# EAGLE design AMFS PCB5 (EAGLE 9.6.2)
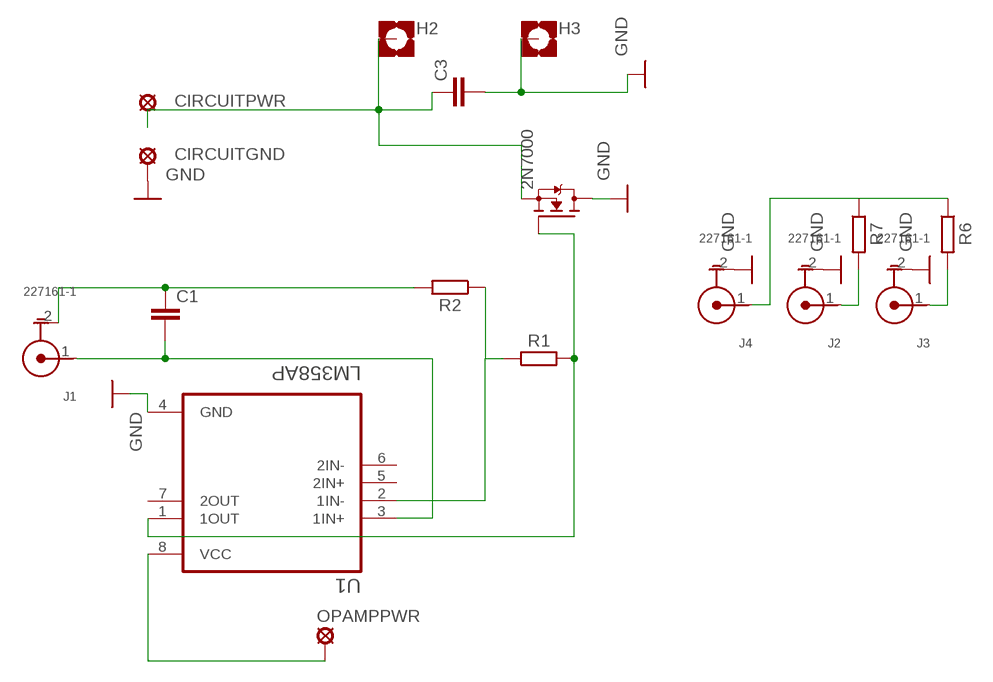
[diagram p0: schematic, sheet 1]

## Parts
C1  C5/3.5  [C5B3.5]
C3  C5/3.5  [C5B3.5]
CIRCUITGND  MCS10B  [MCS10B]
CIRCUITPWR  MCS10B  [MCS10B]
H2  MOUNT-PAD-SQUARE2.8  [2,8-PAD-SQUARE]
H3  MOUNT-PAD-SQUARE2.8  [2,8-PAD-SQUARE]
J1  227161-1  [TE_227161-1]
J2  227161-1  [TE_227161-1]
J3  227161-1  [TE_227161-1]
J4  227161-1  [TE_227161-1]
OPAMPPWR  LSP10  [LSP10]
R1  R_AXIAL-7.2MM-PITCH  [RESAD724W46L381D178B]
R2  R_AXIAL-7.2MM-PITCH  [RESAD724W46L381D178B]
R6  R_AXIAL-7.2MM-PITCH  [RESAD724W46L381D178B]
R7  R_AXIAL-7.2MM-PITCH  [RESAD724W46L381D178B]
SHUNT  2N7000  [TO92-]
U1  LM358AP  [DIP794W45P254L959H508Q8]

## Nets
GND: C3.2 CIRCUITGND.MP H3.B2,8(MOUNT) J2.2(G) J3.2(G) J4.2(G) SHUNT.1(D) U1.4(GND)
N$1: C3.1 CIRCUITPWR.MP H2.B2,8(MOUNT) SHUNT.3(S)
N$2: OPAMPPWR.MP U1.8(VCC)
N$3: C1.2 J1.1(C) U1.3(1IN+)
N$4: C1.1 J1.2(G) R2.2
N$5: R1.1 R2.1 U1.2(1IN-)
N$6: J2.1(C) R7.2
N$7: R1.2 SHUNT.2(G) U1.1(1OUT)
N$8: J3.1(C) R6.2
N$10: J4.1(C) R6.1 R7.1
Unconnected: U1.5(2IN+) U1.6(2IN-) U1.7(2OUT)

## Library data of the parts
C1 C3 = capacitor-wima:C: CAPACITOR naming: grid - package width
CIRCUITGND CIRCUITPWR = solpad:MCS10B: SOLDER PAD MC S1, distributor Buerklin, 15F505
H2 H3 = holes:MOUNT-PAD-SQUARE: MOUNTING PAD, square
J1-J4 = 227161-1:227161-1: CONN BNC JACK R/A 50 OHM PCB Check availability <https://pricing.snapeda.com/parts/227161-1/TE%20Connectivity/view-part?ref=eda>; AVAILABILITY: In Stock; COMMENT: 227161-1; DESCRIPTION: BNC Series 50 Ohm Right Angle Through Hole Jack Female Socket Connector; MF: TE Connectivity; MP: 227161-1; PACKAGE: None; PRICE: None; PURCHASE-URL: https://pricing.snapeda.com/search/part/227161-1/?ref=eda
OPAMPPWR = solpad:LSP10: SOLDER PAD drill 1.0 mm, distributor Buerklin, 12H555
R1 R2 R6 R7 = Resistor:R: Resistor Fixed - Generic; CATEGORY: Resistor; SUB-CATEGORY: Fixed
SHUNT = 2N7000:2N7000: Check availability <https://pricing.snapeda.com/parts/2N7000/STMicroelectronics/view-part?ref=eda>; AVAILABILITY: In Stock; DESCRIPTION: N-Channel 60 V 350mA (Tc) 1W (Tc) Through Hole TO-92-3; MF: STMicroelectronics; MP: 2N7000; PACKAGE: E-PKG AXIAL-LEADED-2 ON Semiconductor; PRICE: None; PURCHASE-URL: https://pricing.snapeda.com/search/part/2N7000/?ref=eda
U1 = LM358AP:LM358AP: Check availability <https://pricing.snapeda.com/parts/LM358AP/Texas%20Instruments/view-part?ref=eda>; AVAILABILITY: In Stock; DESCRIPTION: Dual, 30-V, 700-kHz, 3-mV offset voltage operational amplifier; MF: Texas Instruments; MP: LM358AP; PACKAGE: PDIP-8 Texas; PRICE: None; PURCHASE-URL: https://pricing.snapeda.com/search/part/LM358AP/?ref=eda

## Net classes
0 default: width 0.305 mm, drill 0.813 mm, clearance 0.254 mm

## Board
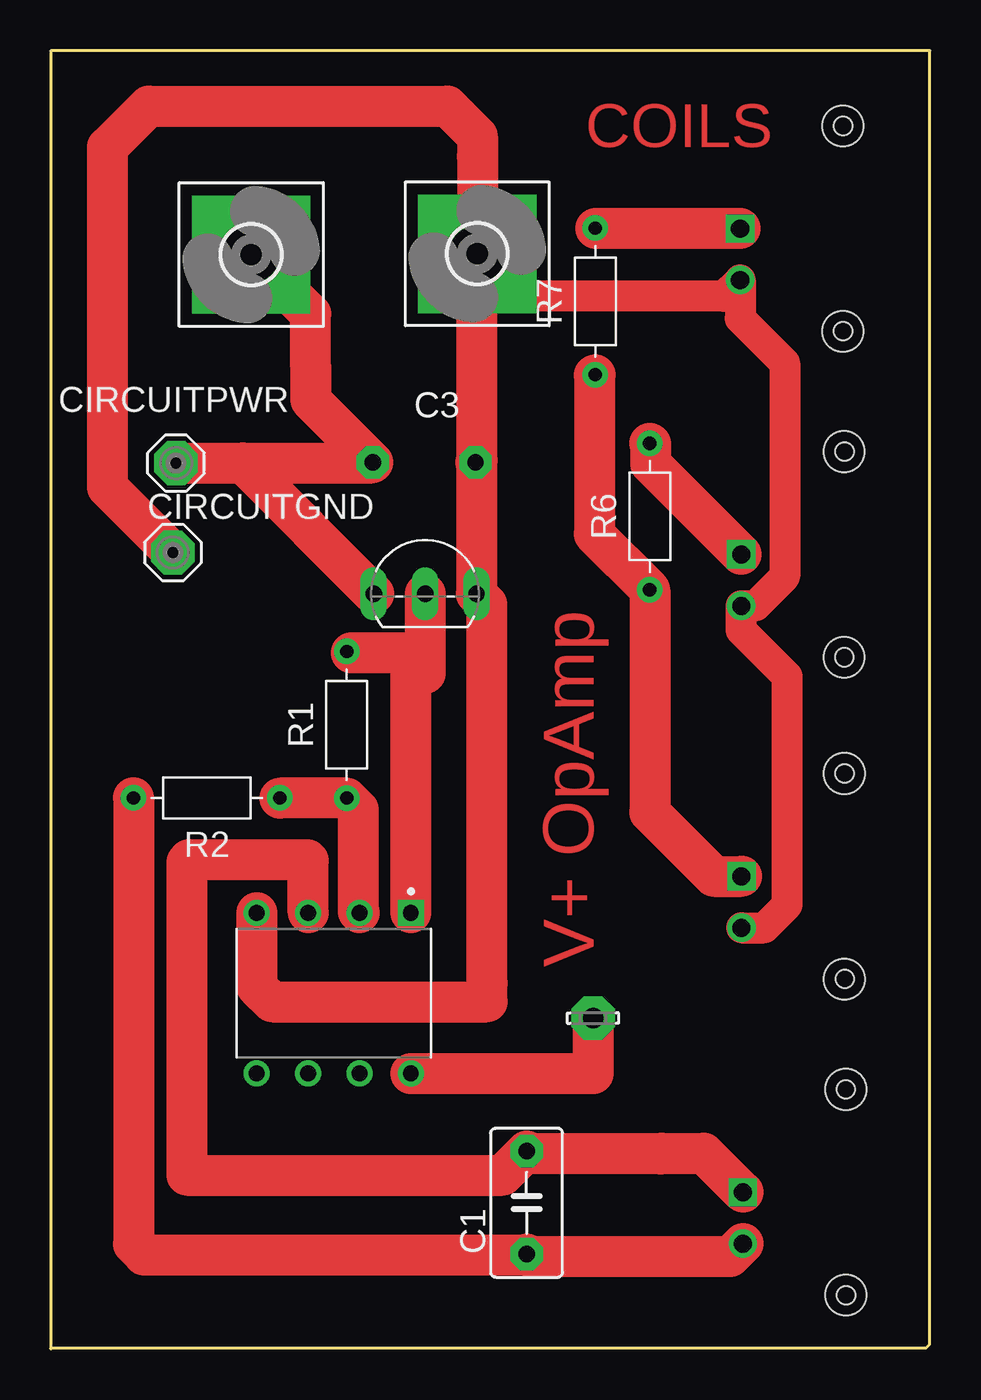
[diagram p1: board, top side]
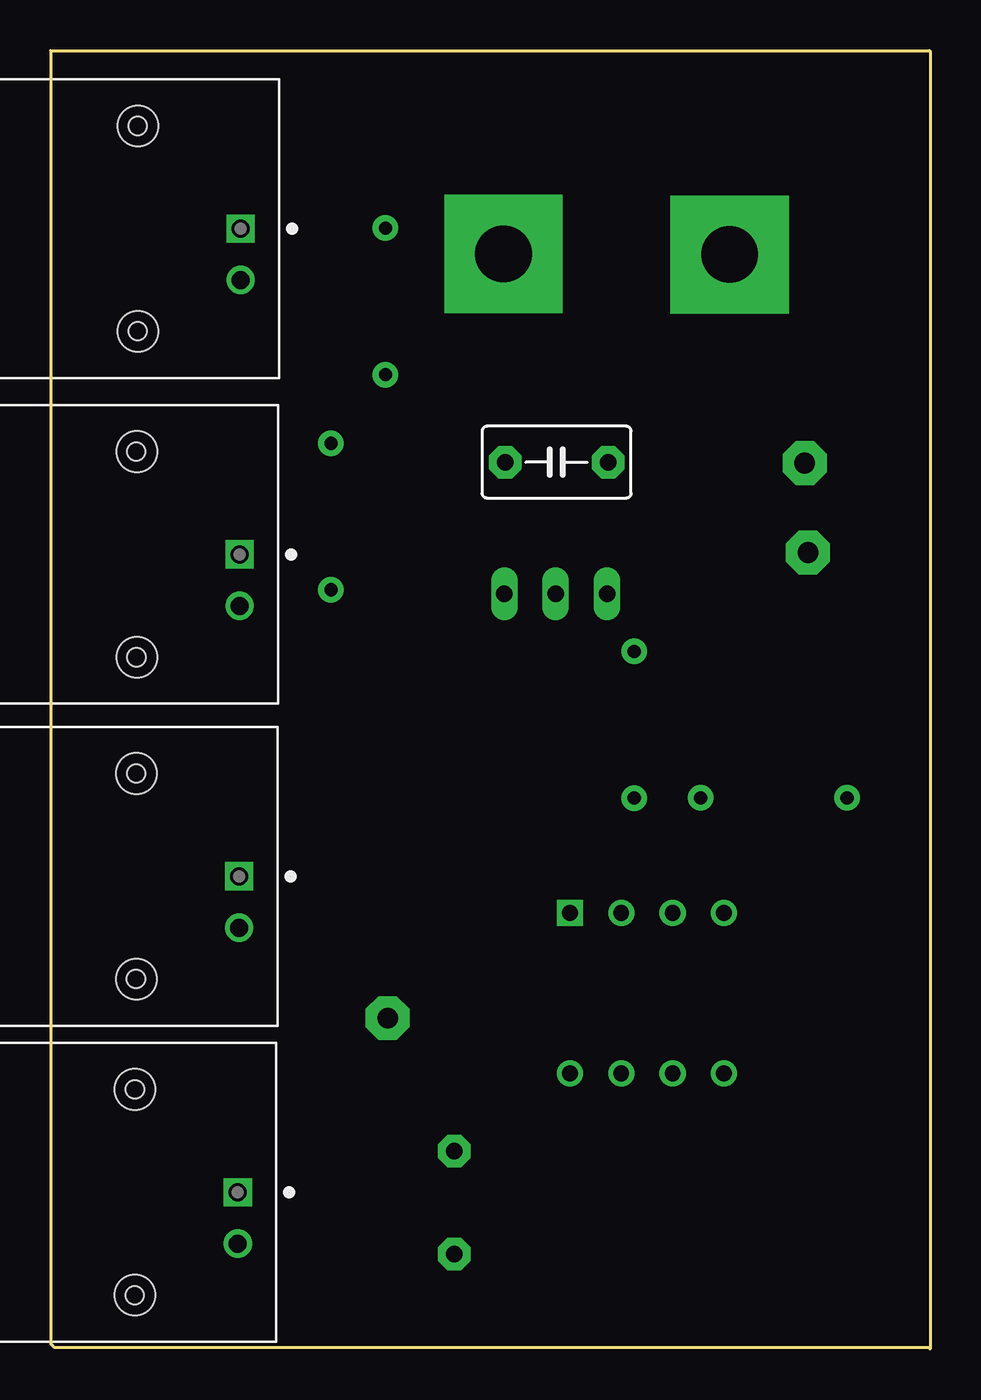
[diagram p2: board, bottom side, seen from below]

Size 43.48 x 64.17 mm. Coordinates in mm from the lower left corner, seen from the top.
Outline: 0.08,0.06 43.29,0.06 43.45,0.22 43.45,64.14 43.48,64.17 0.03,64.17 0,64.14 0,0.01 0.01,0 0.08,0.06
Copper layers (1*16): Top 0.035mm / dielectric 1.5mm / Bottom 0.035mm
Design rules "default": minimum track width 6mil, minimum drill 0.35mm, track to track 6mil, track to pad 6mil, pad to pad 6mil, via to via 6mil, smd to smd 6mil, copper to edge 40mil, drill to drill 6mil, minimum pad ring 10mil, minimum via ring 8mil, stop-mask expansion 4mil, vias tented up to drill 0mil, thermal gap 10mil
Holes 0.9 mm at 39.32,2.66 39.3,12.83 39.18,60.45 39.18,50.3 39.25,44.35 39.24,34.18 39.25,28.44 39.26,18.29

### Footprints (pad centres in the part's own frame; a part is rotated, then mirrored left to right if it is on the bottom)
C5B3.5 = drill 0.813 pad 1.6 octagon: 1 -2.54,0; 2 2.54,0
MCS10B = drill 1.016 pad 2.159 octagon: MP 0,0
2,8-PAD-SQUARE = drill 2.8 pad 5.842 square: B2,8 0,0
TE_227161-1 = drill 0.89 square: 1 0,0 | drill 0.89: 2 -2.54,0 | hole 2.01: -5.08,5.08; 5.08,5.08
LSP10 = drill 1.016 pad 2.159 octagon: MP 0,0
RESAD724W46L381D178B = drill 0.66 pad 1.26: 1 -3.62,0; 2 3.62,0
TO92- = drill 0.813 long: 1 2.54,0; 2 0,0; 3 -2.54,0
DIP794W45P254L959H508Q8 = drill 0.78 pad 1.13 square: 1 -3.97,3.81 | drill 0.78 pad 1.13: 2 -3.97,1.27; 3 -3.97,-1.27; 4 -3.97,-3.81; 5 3.97,-3.81; 6 3.97,-1.27; 7 3.97,1.27; 8 3.97,3.81

### Placement (x,y rotation side)
C1  23.53,7.23 90 top
C3  18.47,43.83 180 bottom
CIRCUITGND  6.04,39.36 0 top
CIRCUITPWR  6.2,43.78 180 top
H2  9.92,54.09 0 top
H3  21.09,54.12 0 top
J1  34.23,7.74 90 bottom
J2  34.09,55.37 90 bottom
J3  34.14,39.27 90 bottom
J4  34.16,23.36 90 bottom
OPAMPPWR  26.82,16.35 180 top
R1  14.64,30.85 90 top
R2  7.72,27.23 180 top
R6  29.62,41.14 90 top
R7  26.92,51.77 90 top
SHUNT  18.51,37.32 0 top
U1  14,17.58 270 top

### Tracks (layer width: path | path; a pad name or v marks a point on that pad's centre or on a via)
GND
  Top 0.305: SHUNT.1 | 10.19,17.91 10.24,17.85 | C3.2 21.05,43.78 | 21.58,18.07 21.57,18.08 | 21.1,54.13 H3.B2,8
  Top 1.524: J4.2 35.28,20.82 36.41,21.95 36.41,33.24 34.14,35.51 J3.2 34.84,36.73 36.29,38.18 36.29,48.72 34.09,50.93 J2.2 33.28,52.02 23.19,52.02 H3.B2,8
  Top 2.032: U1.4 10.19,17.91 | 21.05,43.78 SHUNT.1 21.57,36.8 21.57,18.08 | C3.2 21.09,43.91 H3.B2,8 | 10.24,17.85 10.94,17.16 21.58,17.16 21.58,18.07 | CIRCUITGND.MP 2.82,42.58 2.82,59.4 4.86,61.43 19.62,61.43 21.1,59.95 21.1,58.95 21.1,54.13
N$1
  Top 0.305: 15.88,43.78 C3.1 | 12.85,48.52 12.87,48.53 | CIRCUITPWR.MP 9.51,43.78
  Top 2.032: CIRCUITPWR.MP 15.88,43.78 | C3.1 12.85,46.9 12.85,48.52 12.85,51.15 H2.B2,8 | SHUNT.3 9.51,43.78
N$2
  Top 2.032: U1.8 26.82,13.61 OPAMPPWR.MP
N$3
  Top 0.305: 12.73,24.12 12.68,24.17 | 6.85,24.17 6.74,24.06
  Top 2.032: U1.3 12.73,24.12 | 12.68,24.17 6.85,24.17 | 6.74,24.06 6.74,8.58 22.35,8.58 C1.2 23.66,9.64 30.16,9.64 30.2,9.68 32.29,9.68 J1.1
N$4
  Top 0.305: 23.49,4.65 C1.1
  Top 2.032: R2.2 4.1,5.17 4.63,4.65 23.49,4.65 | C1.1 23.66,4.56 33.58,4.56 J1.2
N$5
  Top 0.305: R2.1
  Top 2.032: U1.2 15.21,21.62 15.21,26.66 R1.1 R2.1
N$6
  Top 0.305: 26.95,55.37 R7.2
  Top 2.032: J2.1 26.95,55.37
N$7
  Top 0.305: R1.2 14.8,34.47 14.87,34.4 | 17.81,34.4 17.81,33.34 18.47,33.34 18.51,33.39
  Top 2.032: U1.1 17.81,33.34 | 17.81,34.4 14.87,34.4 | SHUNT.2 18.51,33.39
N$8
  Top 2.032: R6.2 29.65,44.73 29.65,43.75 J3.1
N$10
  Top 2.032: R7.1 26.88,48.11 26.88,40.28 26.86,40.28 R6.1 29.62,26.52 32.78,23.36 J4.1

### Text on the board
Top: COILS | V+ OpAmp